# EAGLE design acoustics (EAGLE 8.4.0)
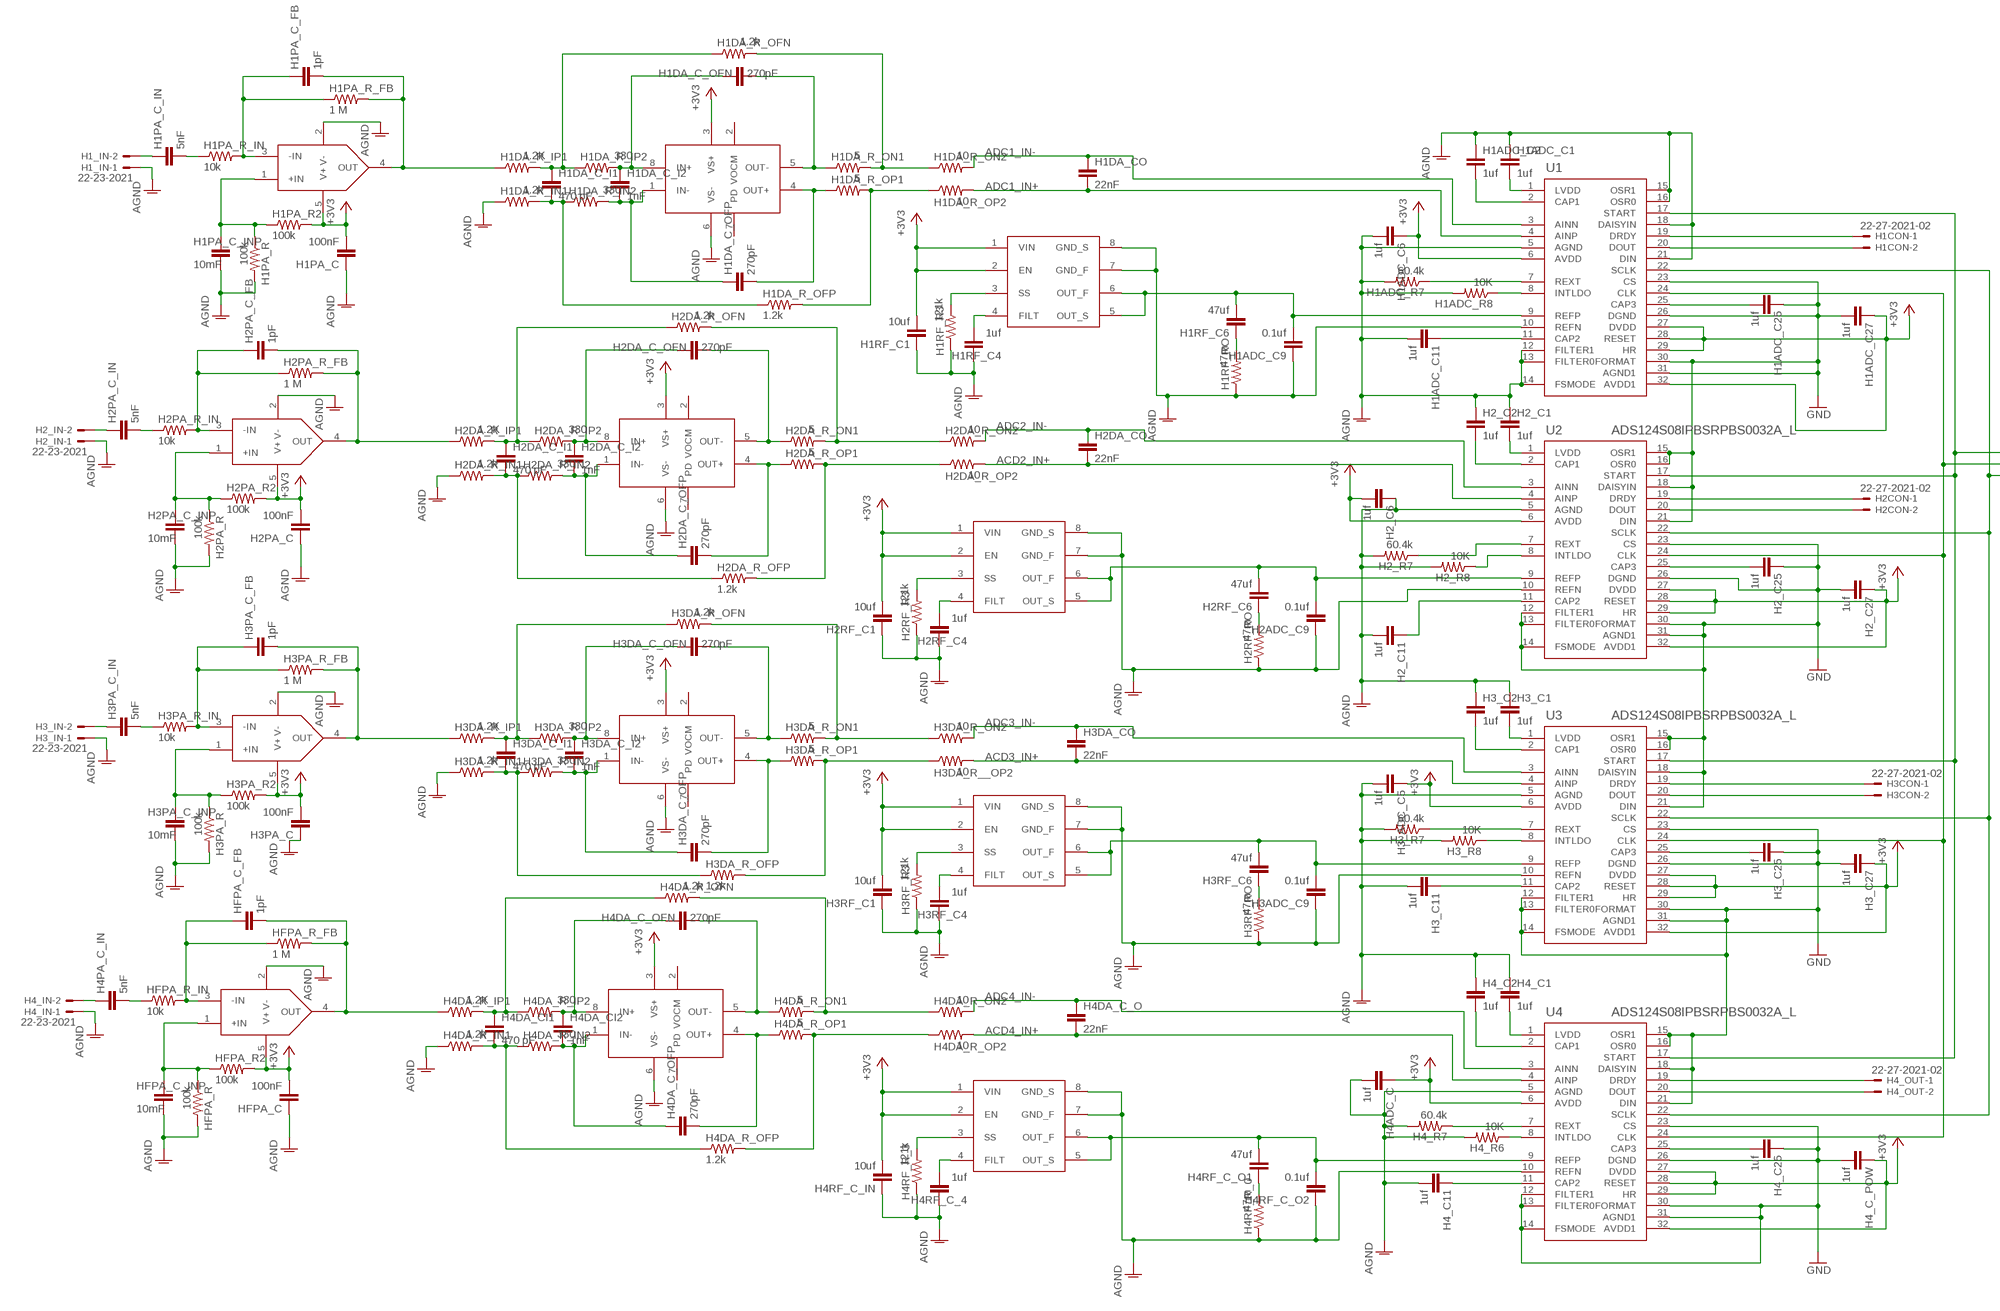
[diagram p0: schematic, sheet 1, part 1 of 2]
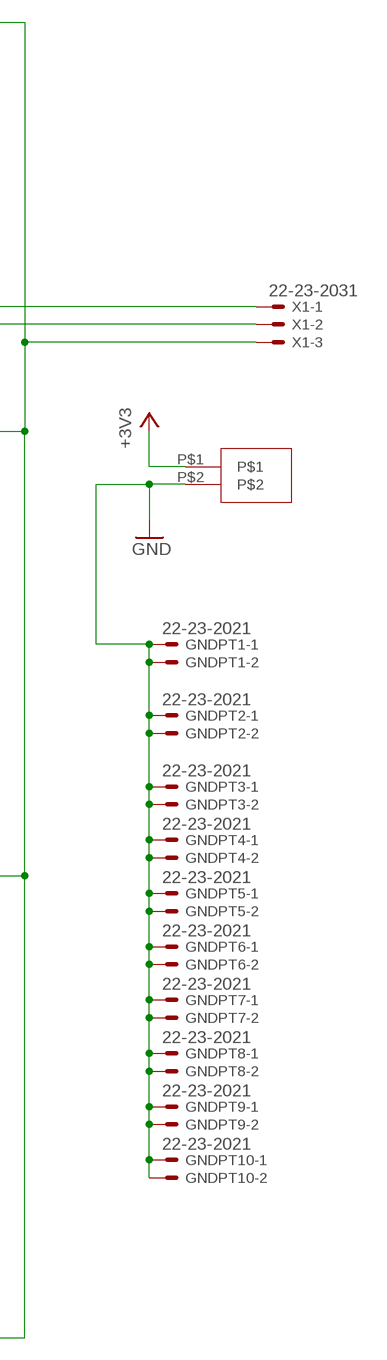
[diagram p1: schematic, sheet 1, part 2 of 2]

## Parts
GNDPT1  22-23-2021  [22-23-2021]
GNDPT2  22-23-2021  [22-23-2021]
GNDPT3  22-23-2021  [22-23-2021]
GNDPT4  22-23-2021  [22-23-2021]
GNDPT5  22-23-2021  [22-23-2021]
GNDPT6  22-23-2021  [22-23-2021]
GNDPT7  22-23-2021  [22-23-2021]
GNDPT8  22-23-2021  [22-23-2021]
GNDPT9  22-23-2021  [22-23-2021]
GNDPT10  22-23-2021  [22-23-2021]
H1_IN  22-23-2021  [22-23-2021]
H1ADC_C1  1uf  C-EUC0603  [C0603]
H1ADC_C2  1uf  C-EUC0603  [C0603]
H1ADC_C6  1uf  C-EUC0603  [C0603]
H1ADC_C9  0.1uf  C-EUC0603  [C0603]
H1ADC_C11  1uf  C-EUC0603  [C0603]
H1ADC_C25  1uf  C-EUC0603  [C0603]
H1ADC_C27  1uf  C-EUC0603  [C0603]
H1ADC_R7  60.4k  R-US_R0603  [R0603]
H1ADC_R8  10K  R-US_R0603  [R0603]
H1CON  22-27-2021-02  [6410-02]
H1DA  THS4551  [VSSOP-8]
H1DA_C_I1  470 pF  C-EUC0603  [C0603]
H1DA_C_I2  1nF  C-EUC0603  [C0603]
H1DA_C_OFN  270pF  C-EUC0603  [C0603]
H1DA_C_OFP  270pF  C-EUC0603  [C0603]
H1DA_CO  22nF  C-EUC0603  [C0603]
H1DA_R_IN1  1.2k  R-US_R0603  [R0603]
H1DA_R_IN2  330  R-US_R0603  [R0603]
H1DA_R_IP1  1.2K  R-US_R0603  [R0603]
H1DA_R_IP2  330  R-US_R0603  [R0603]
H1DA_R_OFN  1.2k  R-US_R0603  [R0603]
H1DA_R_OFP  1.2k  R-US_R0603  [R0603]
H1DA_R_ON1  5  R-US_R0603  [R0603]
H1DA_R_ON2  10  R-US_R0603  [R0603]
H1DA_R_OP1  5  R-US_R0603  [R0603]
H1DA_R_OP2  10  R-US_R0603  [R0603]
H1PA  TLV6741  [SC70-5]
H1PA_C  100nF  C-EUC0603  [C0603]
H1PA_C_FB  1pF  C-EUC0603  [C0603]
H1PA_C_IN  5nF  C-EUC0603  [C0603]
H1PA_C_INP  10mF  C-EUC0603  [C0603]
H1PA_R  100k  R-US_R0603  [R0603]
H1PA_R2  100k  R-US_R0603  [R0603]
H1PA_R_FB  1 M  R-US_R0603  [R0603]
H1PA_R_IN  10k  R-US_R0603  [R0603]
H1RF_C1  10uf  C-EUC0603  [C0603]
H1RF_C4  1uf  C-EUC0603  [C0603]
H1RF_C6  47uf  C-EUC0603  [C0603]
H1RF_R3  121k  R-US_R0603  [R0603]
H1RF_RO  47m  R-US_R0603  [R0603]
H2_C1  1uf  C-EUC0603  [C0603]
H2_C2  1uf  C-EUC0603  [C0603]
H2_C6  1uf  C-EUC0603  [C0603]
H2_C11  1uf  C-EUC0603  [C0603]
H2_C25  1uf  C-EUC0603  [C0603]
H2_C27  1uf  C-EUC0603  [C0603]
H2_IN  22-23-2021  [22-23-2021]
H2_R7  60.4k  R-US_R0603  [R0603]
H2_R8  10K  R-US_R0603  [R0603]
H2ADC_C9  0.1uf  C-EUC0603  [C0603]
H2CON  22-27-2021-02  [6410-02]
H2DA  THS4551  [VSSOP-8]
H2DA_C_I1  470 pF  C-EUC0603  [C0603]
H2DA_C_I2  1nF  C-EUC0603  [C0603]
H2DA_C_OFN  270pF  C-EUC0603  [C0603]
H2DA_C_OFP  270pF  C-EUC0603  [C0603]
H2DA_CO  22nF  C-EUC0603  [C0603]
H2DA_R_IN1  1.2k  R-US_R0603  [R0603]
H2DA_R_IN2  330  R-US_R0603  [R0603]
H2DA_R_IP1  1.2K  R-US_R0603  [R0603]
H2DA_R_IP2  330  R-US_R0603  [R0603]
H2DA_R_OFN  1.2k  R-US_R0603  [R0603]
H2DA_R_OFP  1.2k  R-US_R0603  [R0603]
H2DA_R_ON1  5  R-US_R0603  [R0603]
H2DA_R_ON2  10  R-US_R0603  [R0603]
H2DA_R_OP1  5  R-US_R0603  [R0603]
H2DA_R_OP2  10  R-US_R0603  [R0603]
H2PA  TLV6741  [SC70-5]
H2PA_C  100nF  C-EUC0603  [C0603]
H2PA_C_FB  1pF  C-EUC0603  [C0603]
H2PA_C_IN  5nF  C-EUC0603  [C0603]
H2PA_C_INP  10mF  C-EUC0603  [C0603]
H2PA_R  100k  R-US_R0603  [R0603]
H2PA_R2  100k  R-US_R0603  [R0603]
H2PA_R_FB  1 M  R-US_R0603  [R0603]
H2PA_R_IN  10k  R-US_R0603  [R0603]
H2RF_C1  10uf  C-EUC0603  [C0603]
H2RF_C4  1uf  C-EUC0603  [C0603]
H2RF_C6  47uf  C-EUC0603  [C0603]
H2RF_R3  121k  R-US_R0603  [R0603]
H2RF_RO  47m  R-US_R0603  [R0603]
H3_ADC_C5  1uf  C-EUC0603  [C0603]
H3_C1  1uf  C-EUC0603  [C0603]
H3_C2  1uf  C-EUC0603  [C0603]
H3_C11  1uf  C-EUC0603  [C0603]
H3_C25  1uf  C-EUC0603  [C0603]
H3_C27  1uf  C-EUC0603  [C0603]
H3_IN  22-23-2021  [22-23-2021]
H3_R7  60.4k  R-US_R0603  [R0603]
H3_R8  10K  R-US_R0603  [R0603]
H3ADC_C9  0.1uf  C-EUC0603  [C0603]
H3CON  22-27-2021-02  [6410-02]
H3DA  THS4551  [VSSOP-8]
H3DA_C_I1  470 pF  C-EUC0603  [C0603]
H3DA_C_I2  1nF  C-EUC0603  [C0603]
H3DA_C_OFN  270pF  C-EUC0603  [C0603]
H3DA_C_OFP  270pF  C-EUC0603  [C0603]
H3DA_CO  22nF  C-EUC0603  [C0603]
H3DA_R__OP2  10  R-US_R0603  [R0603]
H3DA_R_IN1  1.2k  R-US_R0603  [R0603]
H3DA_R_IN2  330  R-US_R0603  [R0603]
H3DA_R_IP1  1.2K  R-US_R0603  [R0603]
H3DA_R_IP2  330  R-US_R0603  [R0603]
H3DA_R_OFN  1.2k  R-US_R0603  [R0603]
H3DA_R_OFP  1.2k  R-US_R0603  [R0603]
H3DA_R_ON1  5  R-US_R0603  [R0603]
H3DA_R_ON2  10  R-US_R0603  [R0603]
H3DA_R_OP1  5  R-US_R0603  [R0603]
H3PA  TLV6741  [SC70-5]
H3PA_C  100nF  C-EUC0603  [C0603]
H3PA_C_FB  1pF  C-EUC0603  [C0603]
H3PA_C_IN  5nF  C-EUC0603  [C0603]
H3PA_C_INP  10mF  C-EUC0603  [C0603]
H3PA_R  100k  R-US_R0603  [R0603]
H3PA_R2  100k  R-US_R0603  [R0603]
H3PA_R_FB  1 M  R-US_R0603  [R0603]
H3PA_R_IN  10k  R-US_R0603  [R0603]
H3RF_C1  10uf  C-EUC0603  [C0603]
H3RF_C4  1uf  C-EUC0603  [C0603]
H3RF_C6  47uf  C-EUC0603  [C0603]
H3RF_R3  121k  R-US_R0603  [R0603]
H3RF_RO  47m  R-US_R0603  [R0603]
H4_C1  1uf  C-EUC0603  [C0603]
H4_C2  1uf  C-EUC0603  [C0603]
H4_C11  1uf  C-EUC0603  [C0603]
H4_C25  1uf  C-EUC0603  [C0603]
H4_C_POW  1uf  C-EUC0603  [C0603]
H4_DIFAMP  THS4551  [VSSOP-8]
H4_IN  22-23-2021  [22-23-2021]
H4_OUT  22-27-2021-02  [6410-02]
H4_PREAMP  TLV6741  [SC70-5]
H4_R6  10K  R-US_R0603  [R0603]
H4_R7  60.4k  R-US_R0603  [R0603]
H4_REFGEN  REF6025  [REF6025]
H4ADC_C  1uf  C-EUC0603K  [C0603K]
H4DA_C_O  22nF  C-EUC0603  [C0603]
H4DA_C_OFN  270pF  C-EUC0603  [C0603]
H4DA_C_OFP  270pF  C-EUC0603  [C0603]
H4DA_CI1  470 pF  C-EUC0603  [C0603]
H4DA_CI2  1nF  C-EUC0603  [C0603]
H4DA_R_IN1  1.2k  R-US_R0603  [R0603]
H4DA_R_IN2  330  R-US_R0603  [R0603]
H4DA_R_IP1  1.2K  R-US_R0603  [R0603]
H4DA_R_IP2  330  R-US_R0603  [R0603]
H4DA_R_OFN  1.2k  R-US_R0603  [R0603]
H4DA_R_OFP  1.2k  R-US_R0603  [R0603]
H4DA_R_ON1  5  R-US_R0603  [R0603]
H4DA_R_ON2  10  R-US_R0603  [R0603]
H4DA_R_OP1  5  R-US_R0603  [R0603]
H4DA_R_OP2  10  R-US_R0603  [R0603]
H4PA_C_IN  5nF  C-EUC0603  [C0603]
H4RF_C_4  1uf  C-EUC0603  [C0603]
H4RF_C_IN  10uf  C-EUC0603  [C0603]
H4RF_C_O1  47uf  C-EUC0603  [C0603]
H4RF_C_O2  0.1uf  C-EUC0603  [C0603]
H4RF_R_0  47m  R-US_R0603  [R0603]
H4RF_R_3  121k  R-US_R0603  [R0603]
HFPA_C  100nF  C-EUC0603  [C0603]
HFPA_C_FB  1pF  C-EUC0603  [C0603]
HFPA_C_INP  10mF  C-EUC0603  [C0603]
HFPA_R  100k  R-US_R0603  [R0603]
HFPA_R2  100k  R-US_R0603  [R0603]
HFPA_R_FB  1 M  R-US_R0603  [R0603]
HFPA_R_IN  10k  R-US_R0603  [R0603]
U1  ADS124S08IPBSRPBS0032A_L  [PBS0032A_L]
U2  ADS124S08IPBSRPBS0032A_L  [PBS0032A_L]
U3  ADS124S08IPBSRPBS0032A_L  [PBS0032A_L]
U4  ADS124S08IPBSRPBS0032A_L  [PBS0032A_L]
U$1  REF6025  [REF6025]
U$2  105313-1102  [105313-1102]
U$10  REF6025  [REF6025]
U$11  REF6025  [REF6025]
X1  22-23-2031  [22-23-2031]

## Nets
+3V3: H1ADC_C6.1 H1ADC_C27.1 H1DA.3(VS+) H1PA.5(V+) H1PA_C.2 H1PA_R2.2 H1RF_C1.2 H2_C6.2 H2_C27.1 H2DA.3(VS+) H2PA.5(V+) H2PA_C.2 H2PA_R2.2 H2RF_C1.2 H3_ADC_C5.1 H3_C27.1 H3DA.3(VS+) H3PA.5(V+) H3PA_C.2 H3PA_R2.2 H3RF_C1.2 H4_C_POW.1 H4_DIFAMP.3(VS+) H4_PREAMP.5(V+) H4_REFGEN.1(VIN) H4_REFGEN.2(EN) H4ADC_C.1 H4RF_C_IN.2 HFPA_C.2 HFPA_R2.2 U1.6(AVDD) U1.27(DVDD) U1.28(RESET) U1.29(HR) U1.32(AVDD1) U2.6(AVDD) U2.27(DVDD) U2.28(RESET) U2.29(HR) U2.32(AVDD1) U3.6(AVDD) U3.27(DVDD) U3.28(RESET) U3.29(HR) U3.32(AVDD1) U4.6(AVDD) U4.27(DVDD) U4.28(RESET) U4.29(HR) U4.32(AVDD1) U$1.1(VIN) U$1.2(EN) U$2.P$1 U$10.1(VIN) U$10.2(EN) U$11.1(VIN) U$11.2(EN)
ACD2_IN+: H2DA_CO.2 H2DA_R_OP2.2 U2.4(AINP)
ACD3_IN+: H3DA_CO.2 H3DA_R__OP2.2 U3.4(AINP)
ACD4_IN+: H4DA_C_O.2 H4DA_R_OP2.2 U4.4(AINP)
ADC1_IN+: H1DA_CO.2 H1DA_R_OP2.2 U1.4(AINP)
ADC1_IN-: H1DA_CO.1 H1DA_R_ON2.2 U1.3(AINN)
ADC2_IN-: H2DA_CO.1 H2DA_R_ON2.2 U2.3(AINN)
ADC3_IN-: H3DA_CO.1 H3DA_R_ON2.2 U3.3(AINN)
ADC4_IN-: H4DA_C_O.1 H4DA_R_ON2.2 U4.3(AINN)
CLK: U1.24(CLK) U2.24(CLK) U3.24(CLK) U4.24(CLK) X1.2
DOUT_H1: H1CON.2 U1.20(DOUT)
DOUT_H2: H2CON.2 U2.20(DOUT)
DOUT_H3: H3CON.2 U3.20(DOUT)
DOUT_H4: H4_OUT.2 U4.20(DOUT)
DRDY_H1: H1CON.1 U1.19(DRDY)
DRDY_H2: H2CON.1 U2.19(DRDY)
DRDY_H3: H3CON.1 U3.19(DRDY)
DRDY_H4: H4_OUT.1 U4.19(DRDY)
GND: GNDPT1.1 GNDPT1.2 GNDPT2.1 GNDPT2.2 GNDPT3.1 GNDPT3.2 GNDPT4.1 GNDPT4.2 GNDPT5.1 GNDPT5.2 GNDPT6.1 GNDPT6.2 GNDPT7.1 GNDPT7.2 GNDPT8.1 GNDPT8.2 GNDPT9.1 GNDPT9.2 GNDPT10.1 GNDPT10.2 H1_IN.1 H1ADC_C1.1 H1ADC_C2.1 H1ADC_C6.2 H1ADC_C9.1 H1ADC_C11.2 H1ADC_C25.1 H1ADC_C27.2 H1ADC_R7.2 H1ADC_R8.2 H1DA.6(VS-) H1DA_R_IN1.1 H1PA.2(V-) H1PA_C.1 H1PA_C_INP.2 H1PA_R.2 H1RF_C1.1 H1RF_C4.1 H1RF_R3.1 H1RF_RO.1 H2_C1.1 H2_C2.1 H2_C6.1 H2_C11.2 H2_C25.1 H2_C27.2 H2_IN.1 H2_R7.2 H2_R8.2 H2ADC_C9.1 H2DA.6(VS-) H2DA_R_IN1.1 H2PA.2(V-) H2PA_C.1 H2PA_C_INP.2 H2PA_R.2 H2RF_C1.1 H2RF_C4.1 H2RF_R3.1 H2RF_RO.1 H3_ADC_C5.2 H3_C1.1 H3_C2.1 H3_C11.2 H3_C25.1 H3_C27.2 H3_IN.1 H3_R7.2 H3_R8.2 H3ADC_C9.1 H3DA.6(VS-) H3DA_R_IN1.1 H3PA.2(V-) H3PA_C.1 H3PA_C_INP.2 H3PA_R.2 H3RF_C1.1 H3RF_C4.1 H3RF_R3.1 H3RF_RO.1 H4_C1.1 H4_C2.1 H4_C11.2 H4_C25.1 H4_C_POW.2 H4_DIFAMP.6(VS-) H4_IN.1 H4_PREAMP.2(V-) H4_R6.2 H4_R7.2 H4_REFGEN.7(GND_F) H4_REFGEN.8(GND_S) H4ADC_C.2 H4DA_R_IN1.1 H4RF_C_4.1 H4RF_C_IN.1 H4RF_C_O2.1 H4RF_R_0.1 H4RF_R_3.1 HFPA_C.1 HFPA_C_INP.2 HFPA_R.2 U1.5(AGND) U1.10(REFN) U1.12(FILTER1) U1.13(FILTER0) U1.14(FSMODE) U1.15(OSR1) U1.16(OSR0) U1.18(DAISYIN) U1.21(DIN) U1.23(CS) U1.26(DGND) U1.30(FORMAT) U1.31(AGND1) U2.5(AGND) U2.10(REFN) U2.12(FILTER1) U2.13(FILTER0) U2.14(FSMODE) U2.15(OSR1) U2.16(OSR0) U2.18(DAISYIN) U2.21(DIN) U2.23(CS) U2.26(DGND) U2.30(FORMAT) U2.31(AGND1) U3.5(AGND) U3.10(REFN) U3.12(FILTER1) U3.13(FILTER0) U3.14(FSMODE) U3.15(OSR1) U3.16(OSR0) U3.18(DAISYIN) U3.21(DIN) U3.23(CS) U3.26(DGND) U3.30(FORMAT) U3.31(AGND1) U4.5(AGND) U4.10(REFN) U4.12(FILTER1) U4.13(FILTER0) U4.14(FSMODE) U4.15(OSR1) U4.16(OSR0) U4.18(DAISYIN) U4.21(DIN) U4.23(CS) U4.26(DGND) U4.30(FORMAT) U4.31(AGND1) U$1.7(GND_F) U$1.8(GND_S) U$2.P$2 U$10.7(GND_F) U$10.8(GND_S) U$11.7(GND_F) U$11.8(GND_S) ; supply symbol labelled AGND
H4_REFV: H4_REFGEN.5(OUT_S) H4_REFGEN.6(OUT_F) H4RF_C_O1.2 H4RF_C_O2.2 U4.9(REFP)
N$1: H2_C1.2 U2.1(LVDD)
N$2: H1RF_C4.2 U$1.4(FILT)
N$3: H2_C2.2 U2.2(CAP1)
N$4: H2_R7.1 U2.7(REXT)
N$5: H1_IN.2 H1PA_C_IN.1
N$6: H1ADC_C9.2 H1RF_C6.2 U1.9(REFP) U$1.5(OUT_S) U$1.6(OUT_F)
N$7: H1PA_C_IN.2 H1PA_R_IN.1
N$8: H3_C2.2 U3.2(CAP1)
N$9: H2_C11.1 U2.11(CAP2)
N$10: H1DA.5(OUT-) H1DA_C_OFN.2 H1DA_R_ON1.1
N$11: H4_C1.2 U4.1(LVDD)
N$12: H3_C1.2 U3.1(LVDD)
N$13: H2_C25.2 U2.25(CAP3)
N$14: H2_IN.2 H2PA_C_IN.1
N$15: H1PA.3(-IN) H1PA_C_FB.1 H1PA_R_FB.1 H1PA_R_IN.2
N$16: H1DA.8(IN+) H1DA_C_I2.1 H1DA_C_OFN.1 H1DA_R_IP2.2
N$17: H1DA.1(IN-) H1DA_C_I2.2 H1DA_C_OFP.1 H1DA_R_IN2.2
N$18: H3_R7.1 U3.7(REXT)
N$19: H1DA_R_OFN.2 H1DA_R_ON1.2 H1DA_R_ON2.1
N$20: H1DA_C_I1.1 H1DA_R_IP1.2 H1DA_R_IP2.1 H1DA_R_OFN.1
N$21: H3_C11.1 U3.11(CAP2)
N$22: H2_R8.1 U2.8(INTLDO)
N$23: H3_R8.1 U3.8(INTLDO)
N$24: H4_C2.2 U4.2(CAP1)
N$25: H1DA_C_I1.2 H1DA_R_IN1.2 H1DA_R_IN2.1 H1DA_R_OFP.1
N$26: H1DA.4(OUT+) H1DA_C_OFP.2 H1DA_R_OP1.1
N$27: H1DA_R_OFP.2 H1DA_R_OP1.2 H1DA_R_OP2.1
N$28: H2PA_C_IN.2 H2PA_R_IN.1
N$29: H2PA.3(-IN) H2PA_C_FB.1 H2PA_R_FB.1 H2PA_R_IN.2
N$30: H3_C25.2 U3.25(CAP3)
N$31: H4_R6.1 U4.8(INTLDO)
N$32: H4_R7.1 U4.7(REXT)
N$33: H2DA.5(OUT-) H2DA_C_OFN.2 H2DA_R_ON1.1
N$34: H4_IN.2 H4PA_C_IN.1
N$35: H4_C11.1 U4.11(CAP2)
N$36: H2DA.8(IN+) H2DA_C_I2.1 H2DA_C_OFN.1 H2DA_R_IP2.2
N$37: H3ADC_C9.2 H3RF_C6.2 U3.9(REFP) U$11.5(OUT_S) U$11.6(OUT_F)
N$38: H4_C25.2 U4.25(CAP3)
N$39: H1ADC_C1.2 U1.1(LVDD)
N$40: H1ADC_C2.2 U1.2(CAP1)
N$42: H2RF_C4.2 U$10.4(FILT)
N$43: H2RF_R3.2 U$10.3(SS)
N$44: H1ADC_R7.1 U1.7(REXT)
N$45: H1ADC_R8.1 U1.8(INTLDO)
N$46: H1RF_C6.1 H1RF_RO.2
N$47: H3RF_C4.2 U$11.4(FILT)
N$48: H1ADC_C11.1 U1.11(CAP2)
N$49: H1PA.1(+IN) H1PA_C_INP.1 H1PA_R2.1 H1PA_R.1
N$50: H2DA.1(IN-) H2DA_C_I2.2 H2DA_C_OFP.1 H2DA_R_IN2.2
N$51: H2DA_C_I1.1 H2DA_R_IP1.2 H2DA_R_IP2.1 H2DA_R_OFN.1
N$52: H2DA_C_I1.2 H2DA_R_IN1.2 H2DA_R_IN2.1 H2DA_R_OFP.1
N$53: H2DA.4(OUT+) H2DA_C_OFP.2 H2DA_R_OP1.1
N$54: H4PA_C_IN.2 HFPA_R_IN.1
N$55: H2PA.1(+IN) H2PA_C_INP.1 H2PA_R2.1 H2PA_R.1
N$56: H1ADC_C25.2 U1.25(CAP3)
N$57: H3_IN.2 H3PA_C_IN.1
N$58: H3PA_C_IN.2 H3PA_R_IN.1
N$59: H3PA.3(-IN) H3PA_C_FB.1 H3PA_R_FB.1 H3PA_R_IN.2
N$60: H3DA.5(OUT-) H3DA_C_OFN.2 H3DA_R_ON1.1
N$61: H1RF_R3.2 U$1.3(SS)
N$62: H3DA.8(IN+) H3DA_C_I2.1 H3DA_C_OFN.1 H3DA_R_IP2.2
N$63: H3DA.1(IN-) H3DA_C_I2.2 H3DA_C_OFP.1 H3DA_R_IN2.2
N$64: H3DA_C_I1.1 H3DA_R_IP1.2 H3DA_R_IP2.1 H3DA_R_OFN.1
N$65: H3DA_C_I1.2 H3DA_R_IN1.2 H3DA_R_IN2.1 H3DA_R_OFP.1
N$66: H3DA.4(OUT+) H3DA_C_OFP.2 H3DA_R_OP1.1
N$67: H4DA_R_OFP.2 H4DA_R_OP1.2 H4DA_R_OP2.1
N$68: H3PA.1(+IN) H3PA_C_INP.1 H3PA_R2.1 H3PA_R.1
N$69: H2DA_R_OFN.2 H2DA_R_ON1.2 H2DA_R_ON2.1
N$70: H2DA_R_OFP.2 H2DA_R_OP1.2 H2DA_R_OP2.1
N$71: H4_PREAMP.3(-IN) HFPA_C_FB.1 HFPA_R_FB.1 HFPA_R_IN.2
N$72: H4_DIFAMP.5(OUT-) H4DA_C_OFN.2 H4DA_R_ON1.1
N$73: H4DA_R_OFN.2 H4DA_R_ON1.2 H4DA_R_ON2.1
N$74: H4_DIFAMP.8(IN+) H4DA_C_OFN.1 H4DA_CI2.1 H4DA_R_IP2.2
N$75: H4_DIFAMP.1(IN-) H4DA_C_OFP.1 H4DA_CI2.2 H4DA_R_IN2.2
N$76: H4DA_CI1.1 H4DA_R_IP1.2 H4DA_R_IP2.1 H4DA_R_OFN.1
N$77: H4DA_CI1.2 H4DA_R_IN1.2 H4DA_R_IN2.1 H4DA_R_OFP.1
N$78: H4_DIFAMP.4(OUT+) H4DA_C_OFP.2 H4DA_R_OP1.1
N$79: H3RF_R3.2 U$11.3(SS)
N$80: H4_PREAMP.1(+IN) HFPA_C_INP.1 HFPA_R2.1 HFPA_R.1
N$81: H3DA_R_OFN.2 H3DA_R_ON1.2 H3DA_R_ON2.1
N$82: H3DA_R__OP2.1 H3DA_R_OFP.2 H3DA_R_OP1.2
N$83: H4_REFGEN.4(FILT) H4RF_C_4.2
N$84: H4_REFGEN.3(SS) H4RF_R_3.2
N$85: H4RF_C_O1.1 H4RF_R_0.2
N$86: H2RF_C6.1 H2RF_RO.2
N$87: H3RF_C6.1 H3RF_RO.2
PA-A1+: H1DA_R_IP1.1 H1PA.4(OUT) H1PA_C_FB.2 H1PA_R_FB.2
PA-A1+1: H2DA_R_IP1.1 H2PA.4(OUT) H2PA_C_FB.2 H2PA_R_FB.2
PA-A1+2: H3DA_R_IP1.1 H3PA.4(OUT) H3PA_C_FB.2 H3PA_R_FB.2
PA-A1+3: H4_PREAMP.4(OUT) H4DA_R_IP1.1 HFPA_C_FB.2 HFPA_R_FB.2
POSITIVE_REF: H2ADC_C9.2 H2RF_C6.2 U2.9(REFP) U$10.5(OUT_S) U$10.6(OUT_F)
SCLK: U1.22(SCLK) U2.22(SCLK) U3.22(SCLK) U4.22(SCLK) X1.3
START: U1.17(START) U2.17(START) U3.17(START) U4.17(START) X1.1
Unconnected: H1DA.2(VOCM) H1DA.7(PD) H2DA.2(VOCM) H2DA.7(PD) H3DA.2(VOCM) H3DA.7(PD) H4_DIFAMP.2(VOCM) H4_DIFAMP.7(PD)

## Library data of the parts
GNDPT1-GNDPT10 H1_IN H2_IN H3_IN H4_IN = con-molex:22-23-2021: .100" (2.54mm) Center Header - 2 Pin; MF: MOLEX; MPN: 22-23-2021; OC_FARNELL: 1462926; OC_NEWARK: 25C3832
H1ADC_C1 H1ADC_C2 H1ADC_C6 H1ADC_C9 H1ADC_C11 H1ADC_C25 H1ADC_C27 H1RF_C1 H1RF_C4 H1RF_C6 H2_C1 H2_C2 H2_C6 H2_C11 H2_C25 H2_C27 H2ADC_C9 H2RF_C1 H2RF_C4 H2RF_C6 H3_ADC_C5 H3_C1 H3_C2 H3_C11 H3_C25 H3_C27 H3ADC_C9 H3RF_C1 H3RF_C4 H3RF_C6 H4_C1 H4_C2 H4_C11 H4_C25 H4_C_POW H4ADC_C H4RF_C_4 H4RF_C_IN H4RF_C_O1 H4RF_C_O2 = rcl:C-EU: CAPACITOR, European symbol
H1ADC_R7 H1ADC_R8 H2_R7 H2_R8 H3_R7 H3_R8 H4_R6 H4_R7 = rcl:R-US_: RESISTOR, American symbol
H1CON H2CON H3CON H4_OUT = con-molex:22-?-02: CONNECTOR wire to board 2.54 mm (.1 inch) pitch header; OC_FARNELL: unknown; OC_NEWARK: unknown
H1DA H2DA H3DA H4_DIFAMP = THS4551:THS4551
H1DA_C_I1 H1DA_C_I2 H1DA_C_OFN H1DA_C_OFP H1DA_CO H1PA_C H1PA_C_FB H1PA_C_IN H1PA_C_INP H2DA_C_I1 H2DA_C_I2 H2DA_C_OFN H2DA_C_OFP H2DA_CO H2PA_C H2PA_C_FB H2PA_C_IN H2PA_C_INP H3DA_C_I1 H3DA_C_I2 H3DA_C_OFN H3DA_C_OFP H3DA_CO H3PA_C H3PA_C_FB H3PA_C_IN H3PA_C_INP H4DA_C_O H4DA_C_OFN H4DA_C_OFP H4DA_CI1 H4DA_CI2 H4PA_C_IN HFPA_C HFPA_C_FB HFPA_C_INP = resistor:C-EU: CAPACITOR, European symbol
H1DA_R_IN1 H1DA_R_IN2 H1DA_R_IP1 H1DA_R_IP2 H1DA_R_OFN H1DA_R_OFP H1DA_R_ON1 H1DA_R_ON2 H1DA_R_OP1 H1DA_R_OP2 H1PA_R H1PA_R2 H1PA_R_FB H1PA_R_IN H1RF_R3 H1RF_RO H2DA_R_IN1 H2DA_R_IN2 H2DA_R_IP1 H2DA_R_IP2 H2DA_R_OFN H2DA_R_OFP H2DA_R_ON1 H2DA_R_ON2 H2DA_R_OP1 H2DA_R_OP2 H2PA_R H2PA_R2 H2PA_R_FB H2PA_R_IN H2RF_R3 H2RF_RO H3DA_R__OP2 H3DA_R_IN1 H3DA_R_IN2 H3DA_R_IP1 H3DA_R_IP2 H3DA_R_OFN H3DA_R_OFP H3DA_R_ON1 H3DA_R_ON2 H3DA_R_OP1 H3PA_R H3PA_R2 H3PA_R_FB H3PA_R_IN H3RF_R3 H3RF_RO H4DA_R_IN1 H4DA_R_IN2 H4DA_R_IP1 H4DA_R_IP2 H4DA_R_OFN H4DA_R_OFP H4DA_R_ON1 H4DA_R_ON2 H4DA_R_OP1 H4DA_R_OP2 H4RF_R_0 H4RF_R_3 HFPA_R HFPA_R2 HFPA_R_FB HFPA_R_IN = resistor:R-US_: RESISTOR, American symbol
H1PA H2PA H3PA H4_PREAMP = lio:TLV6741
H4_REFGEN U$1 U$10 U$11 = REF6025:REF6025
U1-U4 = ADS127L01_ADC:ADS124S08IPBSR
U$2 = 105313-1102:105313-1102: https://www.molex.com/pdm_docs/sd/1053131103_sd.pdf
X1 = con-molex:22-23-2031: .100" (2.54mm) Center Header - 3 Pin; MF: MOLEX; MPN: 22-23-2031; OC_FARNELL: 1462950; OC_NEWARK: 30C0862

## Board
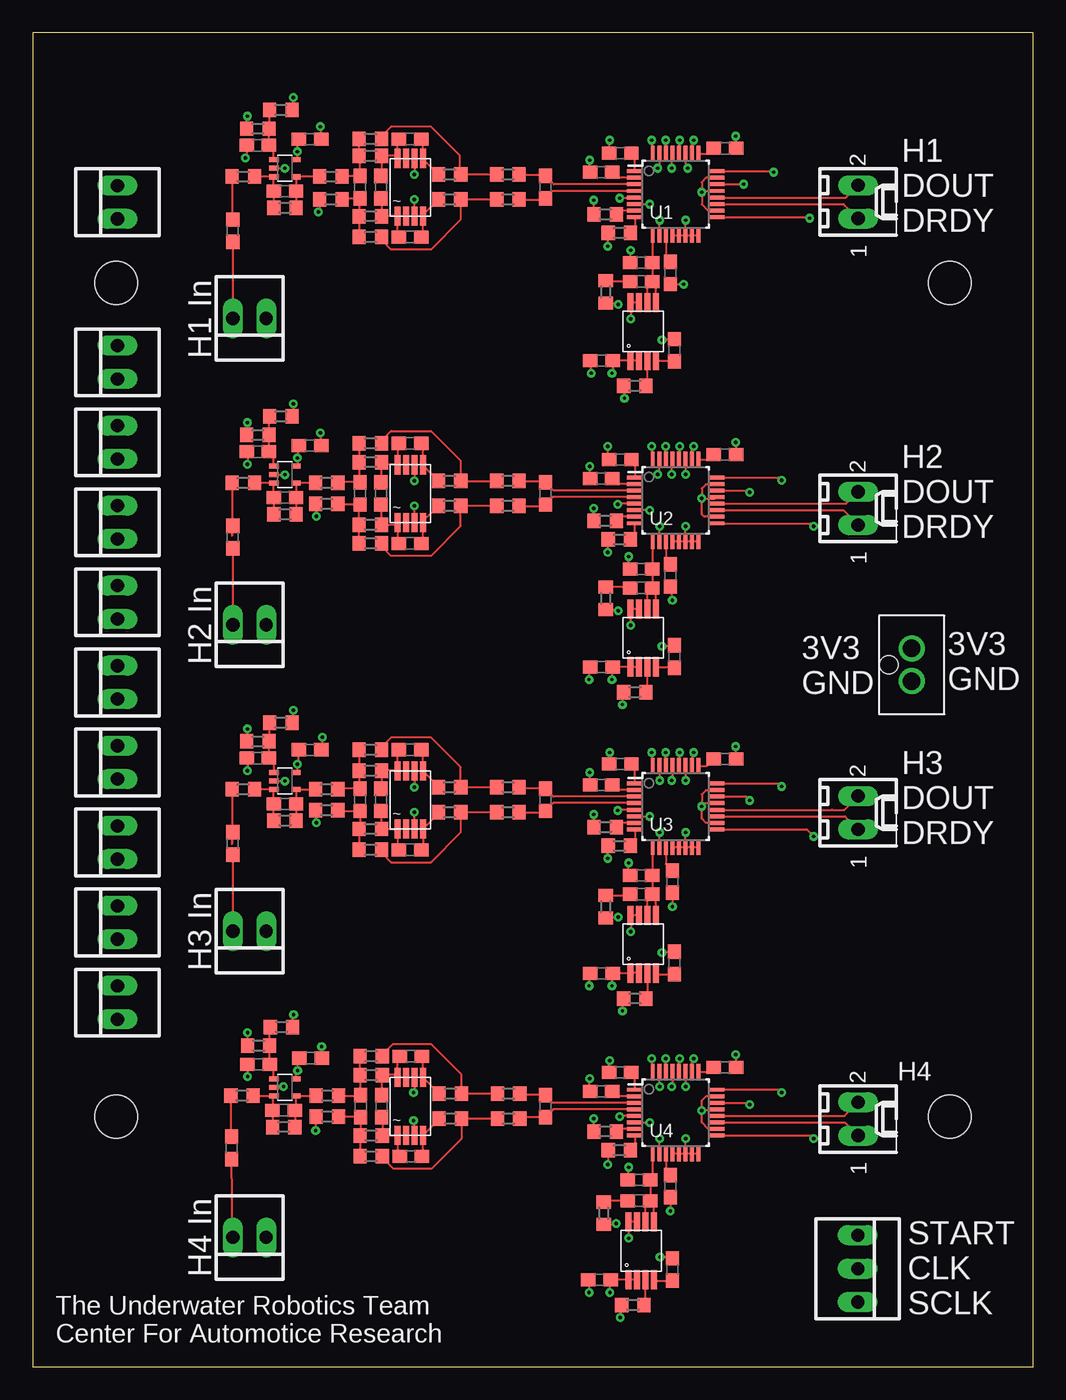
[diagram p2: board, top side]
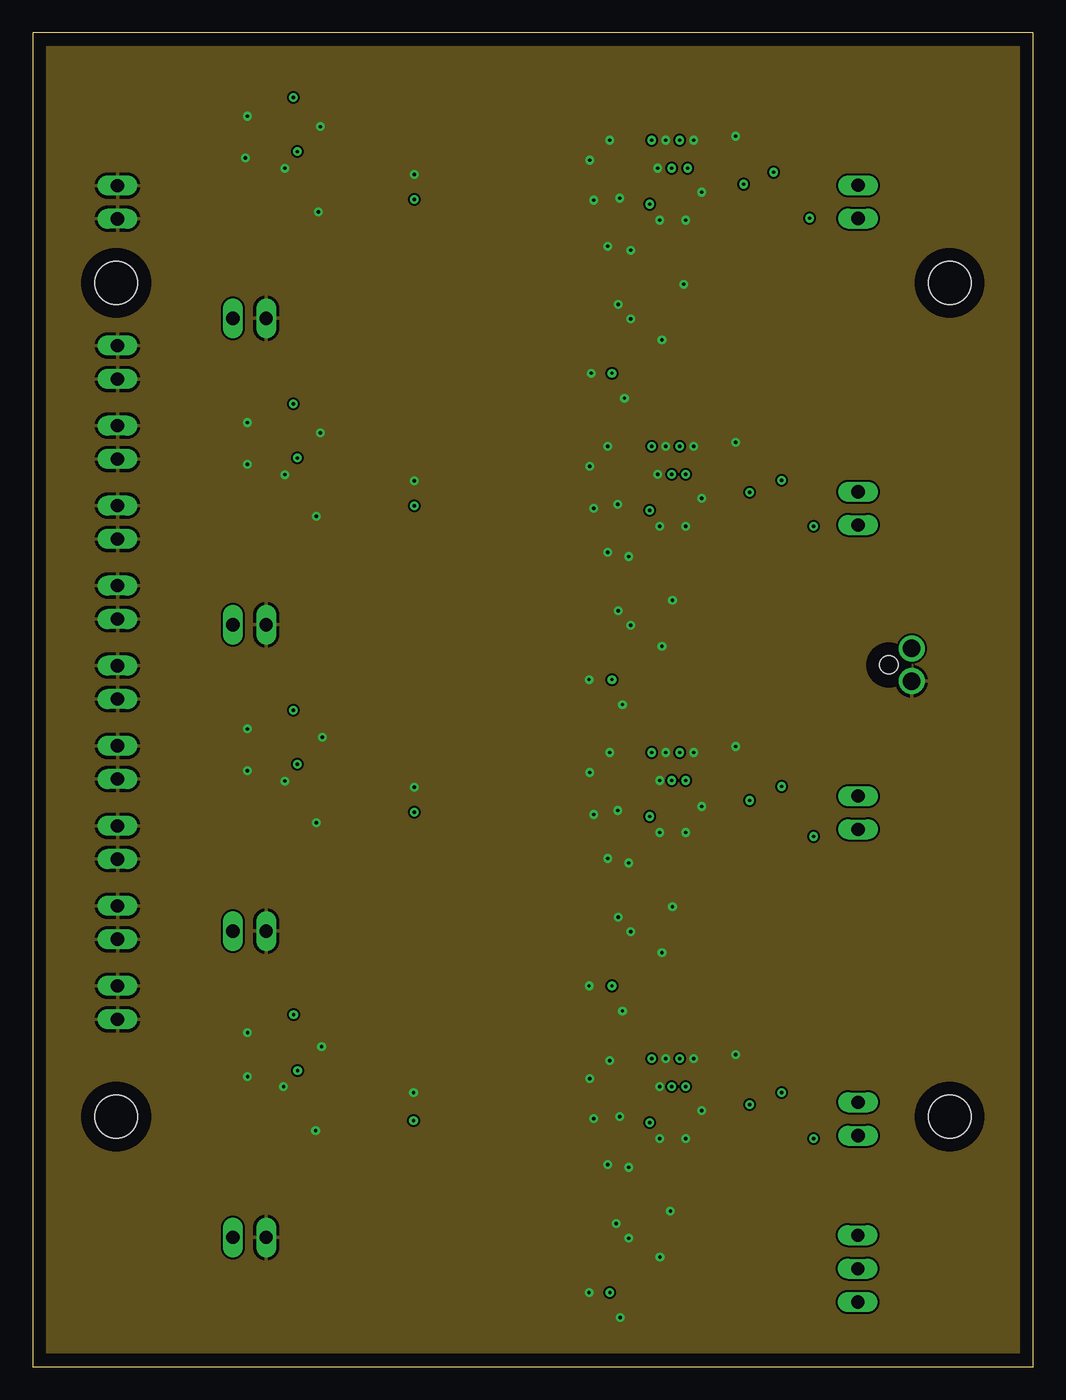
[diagram p3: board, inner layer GND]
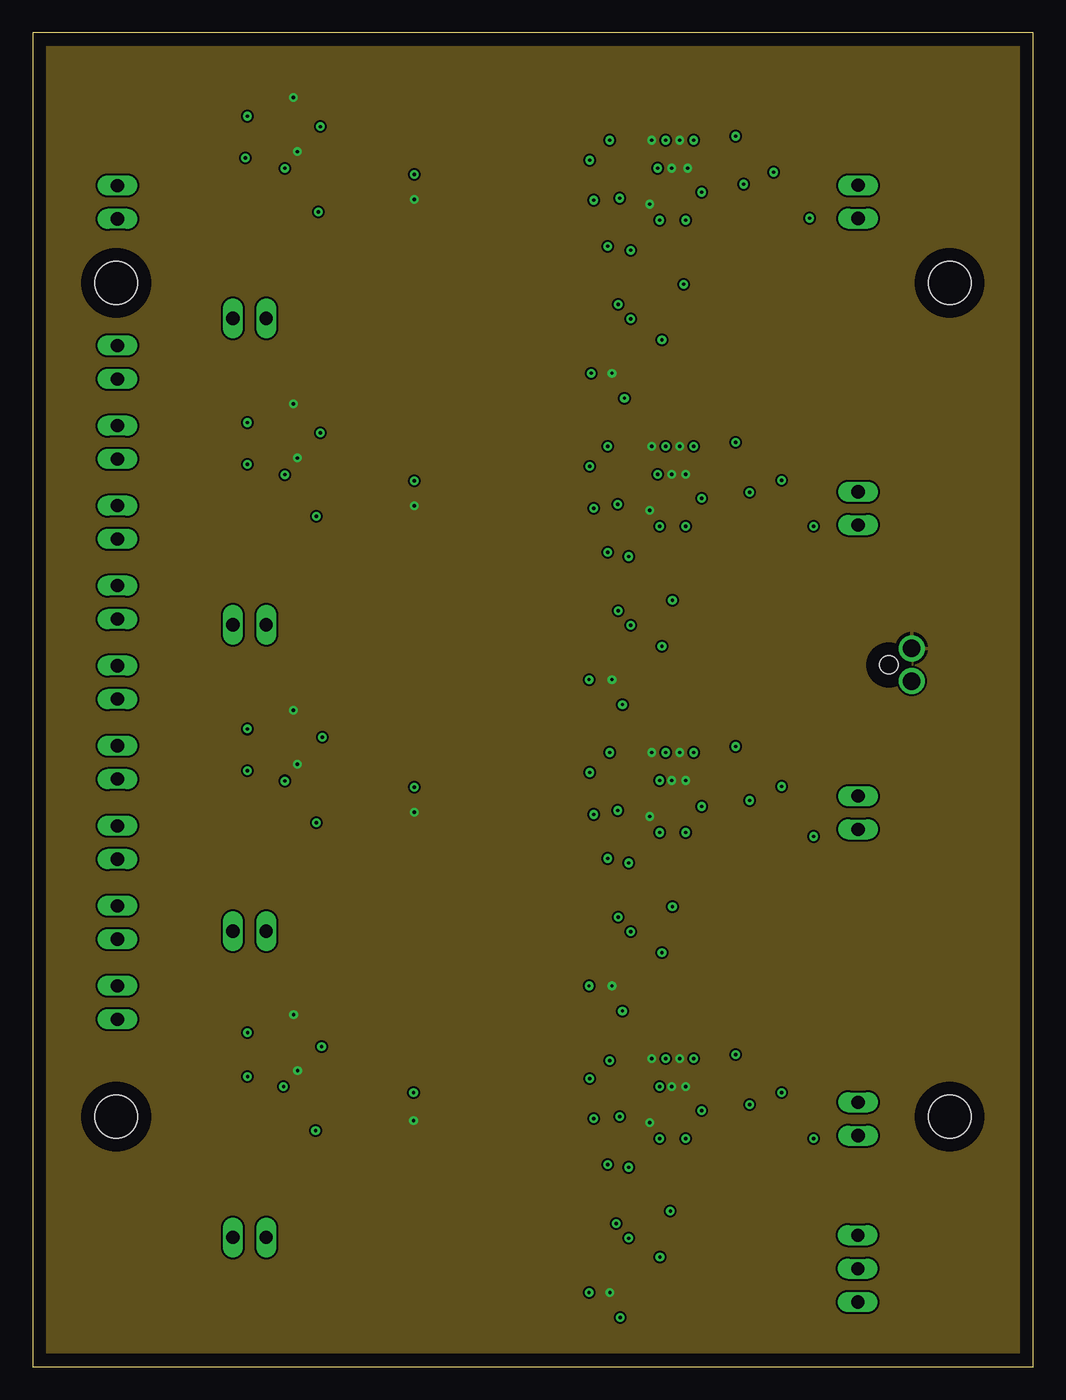
[diagram p4: board, inner layer +3v3]
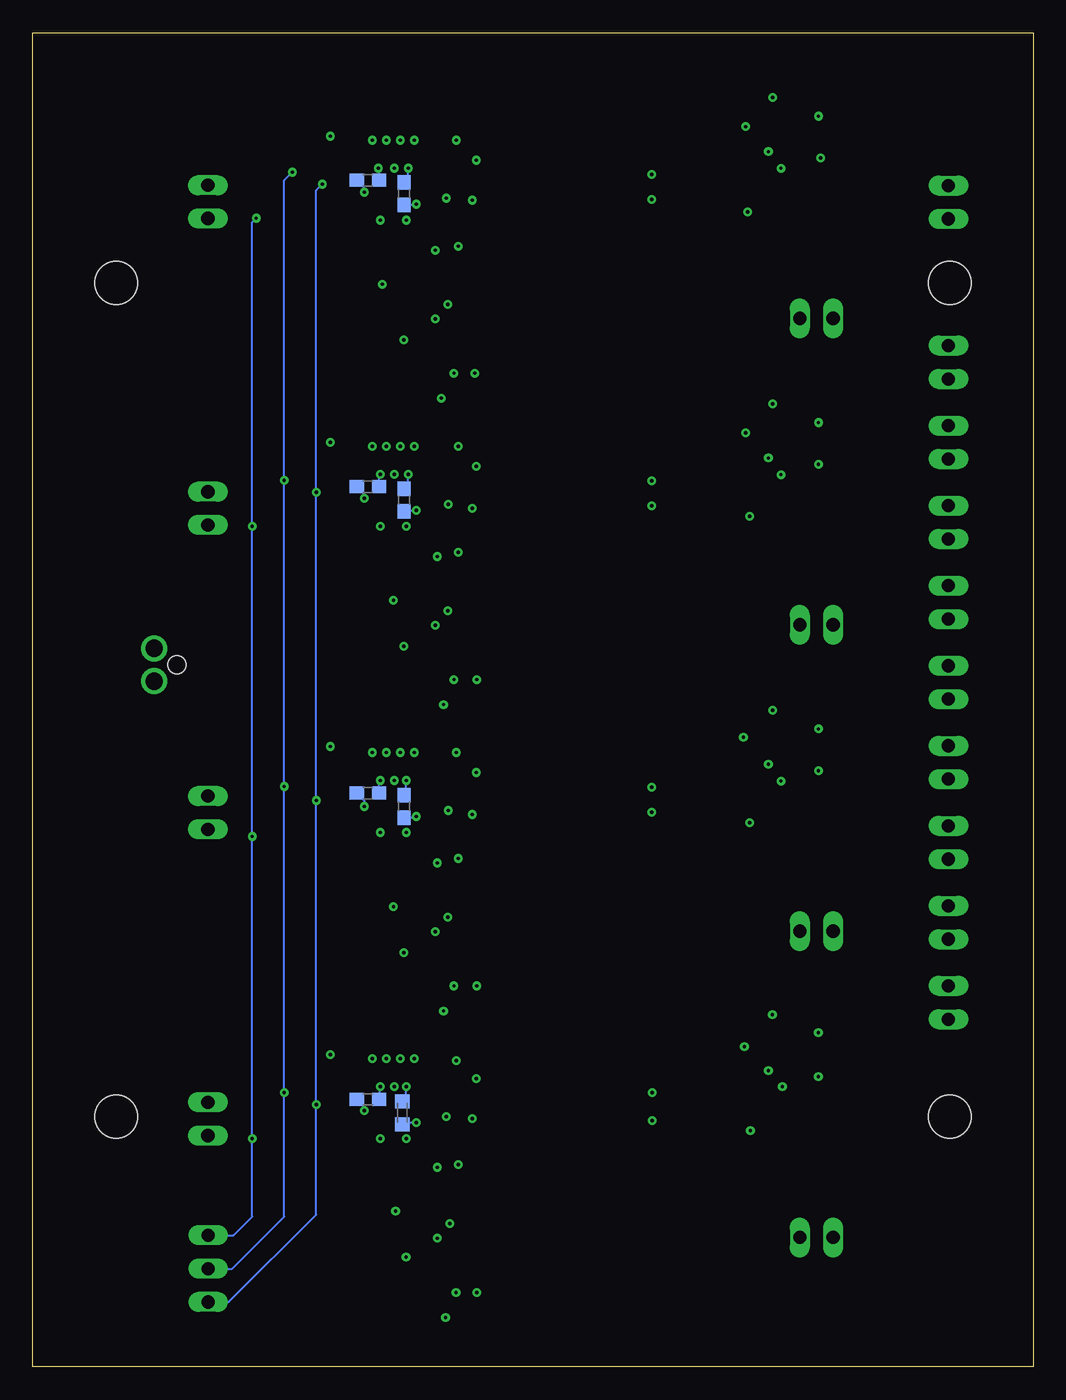
[diagram p5: board, bottom side, seen from below]

Size 76.2 x 101.6 mm. Coordinates in mm from the lower left corner, seen from the top.
Outline: 0,0 76.2,0 76.2,101.6 0,101.6 0,0
Copper layers (1+2*15+16): Top 0.035mm / dielectric 1.5mm / GND 0.035mm / dielectric 0.15mm / +3v3 0.035mm / dielectric 0.2mm / Bottom 0.035mm
Design rules "default *": minimum track width 6mil, minimum drill 0.35mm, track to track 6mil, track to pad 6mil, pad to pad 6mil, via to via 6mil, smd to smd 0mil, copper to edge 40mil, drill to drill 6mil, minimum pad ring 10mil, minimum via ring 8mil, stop-mask expansion 4mil, vias tented up to drill 0mil, thermal gap 10mil
Holes 3.26 mm at 6.35,82.55 69.85,82.55 69.85,19.05 6.35,19.05

### Footprints (pad centres in the part's own frame; a part is rotated, then mirrored left to right if it is on the bottom)
22-23-2021 = drill 1 long: 1 -1.27,0; 2 1.27,0
C0603 = smd 1.1 x 1: 1 -0.85,0; 2 0.85,0
R0603 = smd 1 x 1.1: 1 -0.85,0; 2 0.85,0
6410-02 = drill 1.016 long: 1 1.27,0; 2 -1.27,0
VSSOP-8 = smd 0.45 x 1.45: 1 0,0; 2 0.65,0; 3 1.3,0; 4 1.95,0; 5 1.95,4.4; 6 1.3,4.4; 7 0.65,4.4; 8 0,4.4
SC70-5 = smd 0.4 x 0.7: 1 -0.65,-0.85; 2 0,-0.85; 3 0.65,-0.85; 4 0.65,0.85; 5 -0.65,0.85
REF6025 = smd 0.45 x 1.45: 1 -0.975,-2.2; 2 -0.325,-2.2; 3 0.325,-2.2; 4 0.975,-2.2; 5 0.975,2.2; 6 0.325,2.2; 7 -0.325,2.2; 8 -0.975,2.2
C0603K = smd 1.05 x 1.08: 1 -0.875,0; 2 0.875,0
PBS0032A_L = smd 1.2 x 0.3: 1 -3.1,1.75; 2 -3.1,1.25; 3 -3.1,0.75; 4 -3.1,0.25; 5 -3.1,-0.25; 6 -3.1,-0.75; 7 -3.1,-1.25; 8 -3.1,-1.75; 17 3.1,-1.75; 18 3.1,-1.25; 19 3.1,-0.75; 20 3.1,-0.25; 21 3.1,0.25; 22 3.1,0.75; 23 3.1,1.25; 24 3.1,1.75 | smd 0.3 x 1.2: 9 -1.75,-3.1; 10 -1.25,-3.1; 11 -0.75,-3.1; 12 -0.25,-3.1; 13 0.25,-3.1; 14 0.75,-3.1; 15 1.25,-3.1; 16 1.75,-3.1; 25 1.75,3.1; 26 1.25,3.1; 27 0.75,3.1; 28 0.25,3.1; 29 -0.25,3.1; 30 -0.75,3.1; 31 -1.25,3.1; 32 -1.75,3.1
105313-1102 = drill 1.32: P$1 0,0; P$2 2.5,0 | hole 1.4: 1.25,-1.74
22-23-2031 = drill 1 long: 1 -2.54,0; 2 0,0; 3 2.54,0

### Placement (x,y rotation side)
GNDPT1  6.45,76.5 90 top
GNDPT2  6.45,70.41 90 top
GNDPT3  6.45,64.31 90 top
GNDPT4  6.45,58.22 90 top
GNDPT5  6.45,52.12 90 top
GNDPT6  6.45,46.02 90 top
GNDPT7  6.45,39.93 90 top
GNDPT8  6.45,33.83 90 top
GNDPT9  6.45,27.74 90 top
GNDPT10  6.45,88.7 90 top
H1_IN  16.51,79.85 180 top
H1ADC_C1  44.75,92.42 0 top
H1ADC_C2  43.3,90.98 0 top
H1ADC_C6  47.92,89.35 90 bottom
H1ADC_C9  46.34,84.09 0 top
H1ADC_C11  48.57,83.31 270 top
H1ADC_C25  52.73,92.81 180 top
H1ADC_C27  50.67,90.37 180 bottom
H1ADC_R7  43.61,87.78 180 top
H1ADC_R8  44.68,86.35 180 top
H1CON  62.87,88.72 270 top
H1DA  27.78,87.63 0 top
H1DA_C_I1  24.92,89.85 270 top
H1DA_C_I2  26.51,89.85 270 top
H1DA_C_OFN  28.73,93.5 0 top
H1DA_C_OFP  28.73,86.04 0 top
H1DA_CO  39.05,89.85 270 top
H1DA_R_IN1  22.7,88.9 0 top
H1DA_R_IN2  25.72,87.63 0 top
H1DA_R_IP1  22.7,90.65 0 top
H1DA_R_IP2  25.72,92.23 0 top
H1DA_R_OFN  25.72,93.5 0 top
H1DA_R_OFP  25.72,86.04 0 top
H1DA_R_ON1  31.75,90.81 0 top
H1DA_R_ON2  36.2,90.81 0 top
H1DA_R_OP1  31.75,88.9 0 top
H1DA_R_OP2  36.2,88.9 0 top
H1PA  19.21,91.28 270 top
H1PA_C  21.11,93.5 180 top
H1PA_C_FB  19.21,89.53 0 top
H1PA_C_IN  15.24,86.52 90 top
H1PA_C_INP  17.15,93.03 180 top
H1PA_R  17.15,94.3 180 top
H1PA_R2  18.89,95.73 0 top
H1PA_R_FB  19.21,88.27 0 top
H1PA_R_IN  16.03,90.65 0 top
H1RF_C1  43.33,76.63 0 top
H1RF_C4  48.88,77.42 270 top
H1RF_C6  46.34,82.66 0 top
H1RF_R3  45.87,74.72 0 top
H1RF_RO  43.64,81.86 90 top
H2_C1  44.75,69.09 0 top
H2_C2  43.3,67.65 0 top
H2_C6  47.92,66.01 270 bottom
H2_C11  48.57,60.27 270 top
H2_C25  52.73,69.47 180 top
H2_C27  50.67,67.03 180 bottom
H2_IN  16.51,56.52 180 top
H2_R7  43.61,64.44 180 top
H2_R8  44.68,63 180 top
H2ADC_C9  46.34,60.75 0 top
H2CON  62.87,65.38 270 top
H2DA  27.78,64.29 0 top
H2DA_C_I1  24.92,66.52 270 top
H2DA_C_I2  26.51,66.52 270 top
H2DA_C_OFN  28.73,70.33 0 top
H2DA_C_OFP  28.73,62.71 0 top
H2DA_CO  39.05,66.52 270 top
H2DA_R_IN1  22.38,65.72 0 top
H2DA_R_IN2  25.72,64.14 0 top
H2DA_R_IP1  22.38,67.31 0 top
H2DA_R_IP2  25.72,68.9 0 top
H2DA_R_OFN  25.72,70.33 0 top
H2DA_R_OFP  25.72,62.71 0 top
H2DA_R_ON1  31.75,67.47 0 top
H2DA_R_ON2  36.2,67.47 0 top
H2DA_R_OP1  31.75,65.56 0 top
H2DA_R_OP2  36.2,65.56 0 top
H2PA  19.21,67.94 270 top
H2PA_C  21.11,70.17 180 top
H2PA_C_FB  19.21,66.2 0 top
H2PA_C_IN  15.24,63.18 90 top
H2PA_C_INP  17.15,69.69 180 top
H2PA_R  17.15,70.96 180 top
H2PA_R2  18.89,72.39 0 top
H2PA_R_FB  19.21,64.93 0 top
H2PA_R_IN  16.03,67.31 0 top
H2RF_C1  43.33,53.29 0 top
H2RF_C4  48.88,54.08 270 top
H2RF_C6  46.34,59.32 0 top
H2RF_R3  45.87,51.38 0 top
H2RF_RO  43.64,58.53 90 top
H3_ADC_C5  47.92,42.68 90 bottom
H3_C1  44.75,45.9 0 top
H3_C2  43.3,44.31 0 top
H3_C11  48.72,36.94 270 top
H3_C25  52.73,46.29 180 top
H3_C27  50.67,43.69 180 bottom
H3_IN  16.51,33.17 180 top
H3_R7  43.61,41.1 180 top
H3_R8  44.68,39.67 180 top
H3ADC_C9  46.34,37.41 0 top
H3CON  62.87,42.2 270 top
H3DA  27.78,40.96 0 top
H3DA_C_I1  24.92,43.18 270 top
H3DA_C_I2  26.51,43.18 270 top
H3DA_C_OFN  28.73,46.99 0 top
H3DA_C_OFP  28.73,39.37 0 top
H3DA_CO  39.05,43.18 270 top
H3DA_R__OP2  36.2,42.23 0 top
H3DA_R_IN1  22.38,42.39 0 top
H3DA_R_IN2  25.72,40.96 0 top
H3DA_R_IP1  22.38,43.97 0 top
H3DA_R_IP2  25.72,45.4 0 top
H3DA_R_OFN  25.72,46.99 0 top
H3DA_R_OFP  25.72,39.37 0 top
H3DA_R_ON1  31.75,44.13 0 top
H3DA_R_ON2  36.2,44.13 0 top
H3DA_R_OP1  31.75,42.23 0 top
H3PA  19.21,44.61 270 top
H3PA_C  21.11,46.99 180 top
H3PA_C_FB  19.21,42.86 0 top
H3PA_C_IN  15.24,39.85 90 top
H3PA_C_INP  17.15,46.35 180 top
H3PA_R  17.15,47.62 180 top
H3PA_R2  18.89,49.05 0 top
H3PA_R_FB  19.21,41.59 0 top
H3PA_R_IN  16.03,43.97 0 top
H3RF_C1  43.33,29.95 0 top
H3RF_C4  48.88,30.75 270 top
H3RF_C6  46.34,35.99 0 top
H3RF_R3  45.87,28.05 0 top
H3RF_RO  43.64,35.03 90 top
H4_C1  44.75,22.42 0 top
H4_C2  43.3,20.97 0 top
H4_C11  48.56,13.75 270 top
H4_C25  52.73,22.8 180 top
H4_C_POW  50.67,20.36 180 bottom
H4_DIFAMP  27.78,17.62 0 top
H4_IN  16.51,9.84 180 top
H4_OUT  62.87,18.87 270 top
H4_PREAMP  19.21,21.27 270 top
H4_R6  44.68,16.48 180 top
H4_R7  43.61,17.92 180 top
H4_REFGEN  46.34,8.83 0 top
H4ADC_C  48.06,19.34 90 bottom
H4DA_C_O  39.05,19.84 270 top
H4DA_C_OFN  28.79,23.65 0 top
H4DA_C_OFP  28.79,16.03 0 top
H4DA_CI1  24.98,19.84 270 top
H4DA_CI2  26.57,19.84 270 top
H4DA_R_IN1  22.44,19.05 0 top
H4DA_R_IN2  25.77,17.61 0 top
H4DA_R_IP1  22.44,20.64 0 top
H4DA_R_IP2  25.77,22.22 0 top
H4DA_R_OFN  25.77,23.65 0 top
H4DA_R_OFP  25.77,16.03 0 top
H4DA_R_ON1  31.81,20.79 0 top
H4DA_R_ON2  36.25,20.79 0 top
H4DA_R_OP1  31.81,18.88 0 top
H4DA_R_OP2  36.25,18.88 0 top
H4PA_C_IN  15.14,16.66 90 top
H4RF_C_4  48.72,7.4 270 top
H4RF_C_IN  43.17,6.61 0 top
H4RF_C_O1  46.18,12.64 0 top
H4RF_C_O2  46.18,14.23 0 top
H4RF_R_0  43.48,11.69 90 top
H4RF_R_3  45.71,4.71 0 top
HFPA_C  21.17,23.51 180 top
HFPA_C_FB  19.11,19.53 0 top
HFPA_C_INP  17.2,23.03 180 top
HFPA_R  17.2,24.45 180 top
HFPA_R2  18.95,25.88 0 top
HFPA_R_FB  19.11,18.26 0 top
HFPA_R_IN  15.94,20.64 0 top
U1  48.97,89.31 0 top
U2  48.97,65.99 0 top
U3  48.97,42.67 0 top
U4  48.97,19.35 0 top
U$1  46.5,78.85 0 top
U$2  66.95,54.71 270 top
U$10  46.5,55.51 0 top
U$11  46.5,32.18 0 top
X1  62.84,7.47 270 top

### Tracks (layer width: path | path; a pad name or v marks a point on that pad's centre or on a via)
+3V3  (via drill 0.25, 0.25 pad 0.55)
  Top 0.152: H4_REFGEN.2 H4_REFGEN.1 44.04,6.63 H4RF_C_IN.2 43.96,6.55 v43.96,5.66 | U$11.2 U$11.1 45.5,29.95 H3RF_C1.2 44.12,29.9 v44.12,29 | U$10.2 U$10.1 44.2,53.31 H2RF_C1.2 44.12,53.23 v44.12,52.34 | U$1.2 U$1.1 45.53,76.62 H1RF_C1.2 44.18,75.67 v44.12,75.67 | H3DA.3 29.08,42.2 v29.05,42.23 | H3PA_R2.2 19.84,49.16 v19.84,50.01 | H3PA.5 20.16,45.36 v20.16,45.88 20.26,45.98 H3PA_C.2 | v29.05,65.56 29.05,64.32 H2DA.3 | v19.84,73.34 19.84,72.49 H2PA_R2.2 | H2PA_C.2 20.16,70.06 v20.16,69.22 20.16,68.7 H2PA.5 | v29.05,88.9 29.05,87.66 H1DA.3 | H1PA.5 20.16,92.03 v20.16,92.55 20.16,93.4 H1PA_C.2 | H1PA_R2.2 19.84,95.83 v19.84,96.68 | H4_PREAMP.5 20.06,22.45 v20.17,22.55 20.17,23.35 HFPA_C.2 | HFPA_R2.2 19.8,26.76 v19.86,26.82 | H4_DIFAMP.3 29.08,18.67 v29.01,18.75 | U1.32 47.22,93.34 v47.14,93.42 | U1.29 48.67,92.35 v48.67,91.29 | U1.28 49.28,92.46 v49.28,93.42 | U1.27 49.72,91.45 v49.89,91.29 | U1.6 45.88,88.54 v46.99,88.54 | U2.32 47.22,70.03 v47.14,70.1 | U2.28 49.28,69.14 v49.28,70.1 | U2.29 48.67,69.03 v48.67,67.97 | U2.27 49.72,67.98 v49.73,67.97 | U3.28 49.28,45.83 v49.28,46.79 | U3.27 49.72,44.66 v49.73,44.65 | U3.29 48.72,44.71 v48.67,44.65 | U3.32 47.22,46.71 v47.14,46.79 | U4.32 47.22,23.39 v47.14,23.47 | U4.28 49.22,23.41 v49.28,23.47 | U4.27 v49.72,21.35 v49.73,21.34 | U4.29 48.72,21.39 v48.67,21.34 | U4.6 46.98,18.61 v46.99,18.59 | U3.6 46.98,41.92 v46.99,41.91 | v46.99,65.23 46.98,65.24 U2.6
  Bottom 0.152: H1ADC_C27.1 49.82,91.22 v49.89,91.29 | H1ADC_C6.1 47.03,88.5 v46.99,88.54 | H2_C27.1 49.82,67.88 v49.73,67.97 | H3_C27.1 49.82,44.56 v49.73,44.65 | H4ADC_C.1 47.93,18.59 v46.99,18.59 | H4_C_POW.1 49.73,20.45 v49.73,21.34 | H3_ADC_C5.1 47.07,41.83 v46.99,41.91 | H2_C6.2 47.85,65.23 v46.99,65.23
  pour +3v3: 0.05,101.65 76.25,101.65 76.25,0 0.05,0
ACD2_IN+
  Top 0.152: H2DA_R_OP2.2 38.95,65.56 H2DA_CO.2 39.63,66.24 U2.4
ACD3_IN+
  Top 0.152: H3DA_R__OP2.2 38.95,42.23 H3DA_CO.2 39.64,42.92 U3.4
ACD4_IN+
  Top 0.152: H4DA_R_OP2.2 37.2,18.99 H4DA_C_O.2 39.66,19.61 U4.4
ADC1_IN+
  Top 0.152: H1DA_R_OP2.2 38.95,88.9 H1DA_CO.2 | H1DA_CO.2 39.45,89.4 | U1.4 39.61,89.56 H1DA_CO.2
ADC1_IN-
  Top 0.152: H1DA_R_ON2.2 38.95,90.81 H1DA_CO.1 39.7,90.06 U1.3
ADC2_IN-
  Top 0.152: H2DA_R_ON2.2 38.95,67.47 H2DA_CO.1 39.68,66.74 U2.3
ADC3_IN-
  Top 0.152: H3DA_R_ON2.2 37.15,44.03 H3DA_CO.1 39.66,43.42 U3.3
ADC4_IN-
  Top 0.152: 38.91,20.69 H4DA_C_O.1 | 38.91,20.69 37.19,20.69 H4DA_R_ON2.2 | U4.3 39.5,20.11 38.91,20.69
CLK  (via drill 0.25)
  Top 0.152: U1.24 56.37,91.06 v56.44,90.98 | U2.24 56.82,67.74 v57.05,67.51 | U3.24 56.82,44.42 v57.05,44.2 | U4.24 56.82,21.11 v57.05,20.88
  Bottom 0.152: X1.2 61.01,7.47 57.05,11.43 v57.05,20.88 v57.05,44.2 v57.05,67.51 57.05,90.37 v56.44,90.98
DOUT_H1
  Top 0.152: U1.20 61.93,89.06 H1CON.2
DOUT_H2
  Top 0.152: H2CON.2 61.96,65.74 U2.20
DOUT_H3
  Top 0.152: U3.20 60.86,42.42 | 60.86,42.42 60.91,42.42 | 60.86,42.42 61.82,42.42 H3CON.2
DOUT_H4
  Top 0.152: H4_OUT.2 61.83,19.11 U4.20
DRDY_H1
  Top 0.152: U1.19 61.76,88.56 H1CON.1
DRDY_H2
  Top 0.152: H2CON.1 61.74,65.24 U2.19
DRDY_H3
  Top 0.152: H3CON.1 61.87,41.92 U3.19
DRDY_H4
  Top 0.152: H4_OUT.1 61.86,18.61 U4.19
GND  (via drill 0.25, 0.25 pad 0.55)
  Top 0.152: U$10.7 U$10.8 45.53,56.49 v45.55,56.46 | H2RF_RO.1 44.49,57.68 v44.6,57.58 | U$11.7 U$11.8 45.55,34.35 v45.55,33.13 | H3ADC_C9.1 45.39,37.52 v45.39,38.37 | H3RF_RO.1 43.7,34.24 v44.6,34.24 | H4_REFGEN.7 H4_REFGEN.8 45.37,9.97 v45.39,9.79 | H4RF_R_0.1 44.38,10.84 v44.44,10.9 | H4RF_C_O2.1 45.39,14.29 v45.39,15.18 | v47.93,54.88 47.99,54.93 H2RF_C4.1 | H2RF_C1.1 42.37,53.19 v42.37,52.34 | H2RF_R3.1 44.91,51.28 v44.91,50.43 | H3RF_C4.1 48.83,31.54 v47.93,31.54 | H3RF_C1.1 42.37,29.85 v42.37,29 | H3RF_R3.1 44.91,27.95 v44.91,27.09 | H4RF_C_4.1 48.62,8.36 v47.77,8.36 | H4RF_C_IN.1 42.37,6.55 v42.37,5.66 | H4RF_R_3.1 44.76,4.6 v44.76,3.75 | H4_C11.2 v48.57,11.85 | H3_C11.2 v48.72,35.03 | H2_C11.2 v48.72,58.37 | H2ADC_C9.1 45.39,60.75 v45.39,61.7 | U$1.7 U$1.8 45.55,81.05 v45.55,79.8 | H1RF_RO.1 44.6,81.01 v44.6,80.91 | v47.93,78.21 47.93,78.27 H1RF_C4.1 | H1RF_C1.1 42.48,75.67 v42.53,75.67 | H1RF_R3.1 45.02,73.77 v45.07,73.77 | v45.55,85.04 45.49,85.04 H1ADC_C9.1 | H3DA.6 29.08,44.16 v29.05,44.13 | H3DA_R_IN1.1 21.59,42.33 v21.59,41.43 | H3PA_R.2 16.35,47.68 v16.35,48.58 | H3PA_C_INP.2 16.35,46.3 v16.35,45.4 | H3PA.2 v19.21,44.61 | H3PA_C.1 22.07,47.09 v22.07,47.94 | H2DA_R_IN1.1 21.59,65.67 v21.59,64.77 | H2DA.6 29.08,67.5 v29.05,67.47 | H2PA_R.2 16.35,71.02 v16.35,71.91 | H2PA_C_INP.2 16.35,69.64 v16.35,68.74 | H2PA.2 v19.21,67.94 | H2PA_C.1 21.96,71.06 v21.91,71.12 | H1DA.6 29.08,90.83 v29.05,90.81 | H1DA_R_IN1.1 21.85,88.05 v21.75,87.95 | H1PA_C.1 21.96,94.4 v21.91,94.46 | H1PA_R.2 16.3,95.19 v16.35,95.25 | H1PA_C_INP.2 16.3,92.18 v16.19,92.08 | H1PA.2 v19.21,91.28 | H4_PREAMP.2 19.04,21.27 v19.1,21.34 | HFPA_R.2 v16.35,25.45 v16.36,25.45
  Top 0.152: HFPA_C_INP.2 v16.35,22.1 v16.36,22.1 | HFPA_C.1 22.02,24.36 v22,24.38 | H4DA_R_IN1.1 21.54,19 v21.54,17.98 | H4_DIFAMP.6 29.08,20.95 v29.01,20.88 | H1ADC_R7.2 42.76,88.81 v42.72,88.85 | H1ADC_R8.2 43.79,86.31 v43.79,85.34 | U1.5 45.82,89 v44.7,89 | H1ADC_C2.1 42.42,91.02 v42.42,91.9 | H1ADC_C1.1 43.94,92.46 v43.94,93.42 | U1.31 47.72,91.41 v47.6,91.29 | U1.30 v48.22,93.41 v48.21,93.42 | U1.26 50.22,93.3 v50.34,93.42 | U1.10 47.75,86.24 v47.75,87.33 | U1.12 U1.13 U1.14 | U1.14 U1.15 U1.16 | U1.14 49.73,86.22 v49.73,87.33 | U1.18 51.44,88.06 50.95,88.54 v50.95,89.46 | U1.21 51.05,89.56 v50.95,89.46 | U1.23 51.29,90.56 50.95,90.22 v50.95,89.46 | v53.54,93.73 53.54,92.84 H1ADC_C25.1 | H1ADC_C11.2 v49.57,82.46 v49.58,82.45 | U2.5 44.61,65.74 v44.55,65.68 | H2_R7.2 42.72,64.48 v42.72,65.38 | H2_R8.2 43.79,62.97 v43.79,62.03 | U2.10 47.72,63.98 v47.75,64.01 | U2.12 U2.13 U2.14 | U2.14 U2.15 U2.16 | U2.14 49.72,64 v49.73,64.01 | U2.21 51.97,66.14 v50.95,66.14 | U2.23 52.04,67.21 51.26,67.21 50.95,66.9 v50.95,66.14 | U2.18 51.14,64.74 50.95,64.92 v50.95,66.14 | v47.6,67.97 47.72,68.09 U2.31 | U2.30 48.21,69.1 v48.21,70.1 | H2_C25.1 53.58,70.37 v53.54,70.41 | U2.26 50.22,69.98 v50.34,70.1 | v42.42,68.58 42.42,67.68 H2_C2.1 | v43.79,70.1 43.79,69.2 H2_C1.1 | H3_R7.2 42.76,42.02 v42.72,42.06 | U3.5 44.61,42.42 v44.55,42.37 | H3_R8.2 43.79,39.63 v43.79,38.71 | U3.10 47.75,39.6 v47.75,40.69 | U3.12 U3.13 U3.14 | U3.14 U3.15 U3.16 | U3.14 v49.72,40.68 v49.73,40.69 | U3.21 51.2,42.92 v50.95,42.67 | U3.23 52.04,43.89 51.26,43.89 50.95,43.59 v50.95,42.67 | U3.18 51.29,41.42 50.95,41.76 v50.95,42.67 | U3.31 47.75,45.74 v47.75,44.65 | U3.30 48.21,45.78 v48.21,46.79
  Top 0.152: v50.34,46.79 50.22,46.66 U3.26 | H3_C2.1 42.45,45.23 v42.42,45.26 | H3_C1.1 43.94,45.94 v43.94,46.79 | H3_C25.1 53.54,46.32 v53.54,47.24 | H4_C1.1 43.9,23.27 v43.94,23.32 | H4_C2.1 42.42,21.01 v42.42,21.95 | U4.30 48.22,23.46 v48.21,23.47 | U4.26 50.22,23.35 v50.34,23.47 | H4_C25.1 53.58,23.74 v53.54,23.77 | U4.23 52.04,20.57 51.26,20.57 50.95,20.27 v50.95,19.51 | U4.21 51.97,19.51 v50.95,19.51 | U4.18 51.44,18.11 50.95,18.59 v50.95,19.51 | v47.75,21.34 47.72,21.37 U4.31 | U4.5 44.76,19.11 v44.7,19.05 | U4.10 47.75,16.29 v47.75,17.37 | U4.12 U4.13 U4.14 | U4.14 U4.15 U4.16 | U4.14 v49.72,17.36 v49.73,17.37 | H4_R6.2 43.83,15.43 v43.79,15.39 | H4_R7.2 42.76,18.86 v42.72,18.9
  Bottom 0.152: H1ADC_C6.2 47.6,90.52 v47.6,91.29 | H1ADC_C27.2 50.95,89.8 v50.95,89.46 | H2_C27.2 50.95,66.46 v50.95,66.14 | H2_C6.1 47.6,67.18 v47.6,67.97 | H3_C27.2 50.95,43.12 v50.95,42.67 | H3_ADC_C5.2 47.75,43.69 v47.75,44.65 | H4_C_POW.2 50.95,19.79 v50.95,19.51 | H4ADC_C.2 47.75,20.52 v47.75,21.34
  pour GND: 0.05,101.65 76.25,101.65 76.25,0 0.05,0
H4_REFV
  Top 0.152: H4_REFGEN.6 46.67,12.28 H4RF_C_O1.2 | H4_REFGEN.5 47.32,12.36 H4RF_C_O1.2 | H4RF_C_O2.2 H4RF_C_O1.2 | 46.88,14.39 H4RF_C_O2.2 | U4.9 47.22,14.42 H4RF_C_O2.2
N$1
  Top 0.152: H2_C1.2 45.87,68.82 U2.1
N$2
  Top 0.152: U$1.4 48.88,76.65 H1RF_C4.2
N$3
  Top 0.152: U2.2 44.56,67.24 H2_C2.2
N$4
  Top 0.152: U2.7 44.76,64.74 H2_R7.1
N$5
  Top 0.152: H1PA_C_IN.1 H1_IN.2
N$6
  Top 0.152: U$1.6 46.83,82.66 H1RF_C6.2 | U$1.5 47.48,82.66 H1RF_C6.2 | H1RF_C6.2 H1ADC_C9.2 47.14,84.09 | 47.14,84.09 46.88,84.09 | U1.9 47.22,84.17 47.14,84.09
N$7
  Top 0.152: H1PA_R_IN.1 15.18,87.42 H1PA_C_IN.2
N$8
  Top 0.152: U3.2 44.54,43.92 H3_C2.2
N$9
  Top 0.152: 48.48,61.37 | 48.48,61.37 H2_C11.1 | U2.11 48.22,61.62 48.48,61.37
N$10
  Top 0.152: H1DA_R_ON1.1 29.73,91.97 H1DA.5 29.73,93.36 H1DA_C_OFN.2
N$11
  Top 0.152: U4.1 45.87,22.14 H4_C1.2
N$12
  Top 0.152: U3.1 45.87,45.64 H3_C1.2
N$13
  Top 0.152: U2.25 51.5,69.09 H2_C25.2
N$14
  Top 0.152: H2PA_C_IN.1 H2_IN.2
N$15
  Top 0.152: H1PA_R_FB.1 H1PA_C_FB.1 H1PA.3 16.9,90.63 H1PA_R_IN.2
N$16
  Top 0.152: 27.78,92.23 H1DA.8 | 27.78,92.23 27.78,93.4 H1DA_C_OFN.1 | 27.78,92.23 H1DA_R_IP2.2 26.57,90.76 H1DA_C_I2.1
N$17
  Top 0.152: H1DA_C_I2.2 26.57,88.95 H1DA_R_IN2.2 H1DA.1 27.78,86.14 H1DA_C_OFP.1
N$18
  Top 0.152: U3.7 44.78,41.42 H3_R7.1
N$19
  Top 0.152: H1DA_R_ON2.1 H1DA_R_ON1.2 32.54,90.86 32.54,92.23 30.32,94.46 27.3,94.46 26.57,93.72 H1DA_R_OFN.2
N$20
  Top 0.152: H1DA_R_IP1.2 23.61,90.7 H1DA_C_I1.1 24.92,92.18 H1DA_R_IP2.1 H1DA_R_OFN.1
N$21
  Top 0.152: U3.11 48.22,38.29 H3_C11.1
N$22
  Top 0.152: H2_R8.1 45.87,63.35 U2.8
N$23
  Top 0.152: U3.8 45.87,40.01 H3_R8.1
N$24
  Top 0.152: U4.2 44.52,20.61 H4_C2.2
N$25
  Top 0.152: H1DA_R_IN1.2 23.65,89 H1DA_C_I1.2 24.87,88.95 H1DA_R_IN2.1 H1DA_R_OFP.1
N$26
  Top 0.152: H1DA_C_OFP.2 29.73,86.19 H1DA.4 29.73,87.73 H1DA_R_OP1.1
N$27
  Top 0.152: H1DA_R_OP2.1 H1DA_R_OP1.2 32.6,87.37 30.32,85.09 27.3,85.09 26.57,85.83 H1DA_R_OFP.2
N$28
  Top 0.152: H2PA_R_IN.1 15.18,63.3 H2PA_C_IN.2
N$29
  Top 0.152: H2PA_R_FB.1 H2PA_C_FB.1 H2PA.3 18.34,67.31 H2PA_R_IN.2
N$30
  Top 0.152: U3.25 51.37,45.77 H3_C25.2
N$31
  Top 0.152: U4.8 45.87,16.83 H4_R6.1
N$32
  Top 0.152: U4.7 44.65,18.11 H4_R7.1
N$33
  Top 0.152: H2DA_R_ON1.1 29.73,68.64 H2DA.5 29.73,70.18 H2DA_C_OFN.2
N$34
  Top 0.152: H4_IN.2 H4PA_C_IN.1
N$35
  Top 0.152: 48.53,14.64 48.48,14.69 | 48.53,14.64 H4_C11.1 | U4.11 48.22,14.95 48.53,14.64
N$36
  Top 0.152: H2DA_C_I2.1 26.57,67.42 H2DA_R_IP2.2 26.77,68.69 H2DA.8 27.78,70.22 H2DA_C_OFN.1
N$37
  Top 0.152: U$11.6 46.83,35.62 47.09,35.88 | 47.09,35.88 H3RF_C6.2 47.19,37.1 | U$11.5 47.48,35.49 47.09,35.88 | 47.19,37.1 H3ADC_C9.2 47.22,37.44 U3.9 | 46.88,37.41 47.19,37.1
N$38
  Top 0.152: U4.25 51.54,22.45 H4_C25.2
N$39
  Top 0.152: U1.1 45.87,92.16 H1ADC_C1.2
N$40
  Top 0.152: U1.2 44.58,90.56 H1ADC_C2.2
N$42
  Top 0.152: U$10.4 48.8,53.31 H2RF_C4.2
N$43
  Top 0.152: H2RF_R3.2 46.83,51.38 U$10.3
N$44
  Top 0.152: U1.7 44.74,88.06 H1ADC_R7.1
N$45
  Top 0.152: U1.8 45.87,86.84 H1ADC_R8.1
N$46
  Top 0.152: H1RF_C6.1 43.64,82.66 H1RF_RO.2
N$47
  Top 0.152: U$11.4 47.55,29.9 H3RF_C4.2
N$48
  Top 0.152: U1.11 48.22,84.51 H1ADC_C11.1
N$49
  Top 0.152: H1PA.1 18.36,92.66 H1PA_C_INP.1 H1PA_R.1 18.04,94.34 H1PA_R2.1
N$50
  Top 0.152: H2DA_C_OFP.1 27.78,62.81 H2DA.1 27.62,64.14 H2DA_R_IN2.2 26.51,64.19 H2DA_C_I2.2
N$51
  Top 0.152: H2DA_R_OFN.1 H2DA_R_IP2.1 24.87,67.42 H2DA_C_I1.1 23.29,67.37 H2DA_R_IP1.2
N$52
  Top 0.152: H2DA_R_OFP.1 H2DA_R_IN2.1 24.87,65.61 H2DA_C_I1.2 23.29,65.67 H2DA_R_IN1.2
N$53
  Top 0.152: H2DA_C_OFP.2 29.73,62.85 H2DA.4 29.73,64.39 H2DA_R_OP1.1
N$54
  Top 0.152: HFPA_R_IN.1 15.09,17.57 H4PA_C_IN.2
N$55
  Top 0.152: H2PA.1 18.36,69.33 H2PA_C_INP.1 H2PA_R.1 18,72.34 H2PA_R2.1
N$56
  Top 0.152: U1.25 51.48,92.41 H1ADC_C25.2
N$57
  Top 0.152: H3PA_C_IN.1 H3_IN.2
N$58
  Top 0.152: H3PA_R_IN.1 15.18,39.8 H3PA_C_IN.2
N$59
  Top 0.152: H3PA_R_FB.1 H3PA_C_FB.1 H3PA.3 16.9,43.96 H3PA_R_IN.2
N$60
  Top 0.152: H3DA_R_ON1.1 30.9,44.19 H3DA.5 29.73,46.84 H3DA_C_OFN.2
N$61
  Top 0.152: H1RF_R3.2 46.83,74.72 U$1.3
N$62
  Top 0.152: H3DA_C_OFN.1 27.78,46.89 H3DA.8 27.74,45.4 H3DA_R_IP2.2 26.57,44.09 H3DA_C_I2.1
N$63
  Top 0.152: 26.57,42.27 H3DA_C_I2.2 26.51,41.01 H3DA_R_IN2.2 H3DA.1 27.78,39.47 H3DA_C_OFP.1
N$64
  Top 0.152: H3DA_R_OFN.1 H3DA_R_IP2.1 24.87,44.09 H3DA_C_I1.1 23.29,44.03 H3DA_R_IP1.2
N$65
  Top 0.152: H3DA_R_IN1.2 23.29,42.33 H3DA_C_I1.2 24.92,41.01 H3DA_R_IN2.1 H3DA_R_OFP.1
N$66
  Top 0.152: H3DA_R_OP1.1 30.9,42.13 H3DA.4 29.73,39.52 H3DA_C_OFP.2
N$67
  Top 0.152: H4DA_R_OP2.1 H4DA_R_OP1.2 32.66,17.37 30.38,15.09 27.48,15.09 26.62,15.95 H4DA_R_OFP.2
N$68
  Top 0.152: H3PA.1 18.36,45.99 H3PA_C_INP.1 H3PA_R.1 18.04,47.67 H3PA_R2.1
N$69
  Top 0.152: H2DA_R_ON2.1 H2DA_R_ON1.2 32.6,69 30.32,71.28 27.3,71.28 26.57,70.54 H2DA_R_OFN.2
N$70
  Top 0.152: H2DA_R_OP2.1 H2DA_R_OP1.2 32.6,64.03 30.32,61.75 27.3,61.75 26.57,62.49 H2DA_R_OFP.2
N$71
  Top 0.152: HFPA_R_IN.2 16.81,20.62 H4_PREAMP.3 18.26,20.53 HFPA_C_FB.1 HFPA_R_FB.1
N$72
  Top 0.152: 29.64,21.96 H4_DIFAMP.5 | H4_DIFAMP.5 H4DA_R_ON1.1 | H4_DIFAMP.5 29.73,23.56 H4DA_C_OFN.2
N$73
  Top 0.152: H4DA_R_ON2.1 H4DA_R_ON1.2 32.66,22.26 30.38,24.54 27.39,24.54 26.62,23.77 | 26.62,23.77 26.62,23.83 | 26.62,23.77 H4DA_R_OFN.2
N$74
  Top 0.152: H4_DIFAMP.8 27.78,22.25 | H4DA_C_OFN.1 27.78,23.49 27.78,22.25 | 27.78,22.25 26.66,22.25 H4DA_R_IP2.2 26.57,22.16 H4DA_CI2.1
N$75
  Top 0.152: H4DA_CI2.2 26.62,18.94 H4DA_R_IN2.2 H4_DIFAMP.1 27.78,16.19 H4DA_C_OFP.1
N$76
  Top 0.152: H4DA_R_IP1.2 24.93,20.64 H4DA_CI1.1 24.98,22.16 H4DA_R_IP2.1 H4DA_R_OFN.1
N$77
  Top 0.152: H4DA_R_IN1.2 24.93,19.05 H4DA_CI1.2 24.98,17.67 H4DA_R_IN2.1 H4DA_R_OFP.1
N$78
  Top 0.152: H4DA_C_OFP.2 29.73,16.12 H4_DIFAMP.4 30.96,18.85 H4DA_R_OP1.1
N$79
  Top 0.152: U$11.3 46.83,28.16 H3RF_R3.2
N$80
  Top 0.152: H4_PREAMP.1 18.36,22.72 HFPA_C_INP.1 HFPA_R.1 18.05,25.83 HFPA_R2.1
N$81
  Top 0.152: H3DA_R_ON2.1 H3DA_R_ON1.2 32.6,45.66 30.32,47.94 27.3,47.94 26.57,47.2 | 26.57,47.15 H3DA_R_OFN.2 | 26.57,47.15 26.57,47.2 | 26.57,47.2 26.57,47.15
N$82
  Top 0.152: H3DA_R__OP2.1 H3DA_R_OP1.2 32.6,40.7 30.32,38.42 27.3,38.42 26.57,39.16 H3DA_R_OFP.2
N$83
  Top 0.152: H4_REFGEN.4 47.4,6.55 H4RF_C_4.2
N$84
  Top 0.152: H4RF_R_3.2 46.67,4.82 H4_REFGEN.3
N$85
  Top 0.152: H4RF_C_O1.1 43.59,12.64 H4RF_R_0.2
N$86
  Top 0.152: H2RF_C6.1 45.44,59.38 H2RF_RO.2
N$87
  Top 0.152: H3RF_RO.2 45.39,35.88 H3RF_C6.1
PA-A1+
  Top 0.152: H1DA_R_IP1.1 21.84,90.63 H1PA.4 H1PA_C_FB.2 H1PA_R_FB.2
PA-A1+1
  Top 0.152: H2DA_R_IP1.1 20.07,67.31 H2PA.4 H2PA_C_FB.2 H2PA_R_FB.2
PA-A1+2
  Top 0.152: H3DA_R_IP1.1 20.07,43.97 H3PA.4 H3PA_C_FB.2 H3PA_R_FB.2
PA-A1+3
  Top 0.152: HFPA_R_FB.2 HFPA_C_FB.2 20.06,19.63 H4_PREAMP.4 21.57,20.62 H4DA_R_IP1.1
POSITIVE_REF
  Top 0.152: U$10.6 46.83,58.95 H2RF_C6.2 | U$10.5 47.48,59.04 H2RF_C6.2 | 46.88,61.07 H2ADC_C9.2 | U2.9 47.19,62.86 H2ADC_C9.2 | H2ADC_C9.2 H2RF_C6.2
SCLK  (via drill 0.25)
  Top 0.152: U1.22 54.14,90.06 v54.15,90.07 | U2.22 54.47,66.74 v54.61,66.6 | U3.22 52.08,43.43 54.3,43.43 v54.61,43.13 | U4.22 54.47,20.11 v54.61,19.96
  Bottom 0.152: X1.3 61.27,4.93 54.61,11.58 v54.61,19.96 v54.61,43.13 v54.61,66.6 54.61,89.61 v54.15,90.07
START  (via drill 0.25)
  Top 0.152: U1.17 59.1,87.56 v59.18,87.48 | U2.17 59.26,64.24 v59.49,64.01 | 52.15,40.84 U3.17 58.95,40.92 v59.49,40.39 | U4.17 59.26,17.61 v59.49,17.37
  Bottom 0.152: X1.1 60.91,10.01 59.49,11.43 v59.49,17.37 v59.49,40.39 v59.49,64.01 59.49,87.17 v59.18,87.48

### Text on the board
tNames: H1 / DOUT / DRDY | H1 In | H2 / DOUT / DRDY | H2 In | 3V3 / GND | 3V3 / GND | H3 / DOUT / DRDY | H3 In | H4 | H4 In | START / CLK / SCLK | The Underwater Robotics Team / Center For Automotice Research